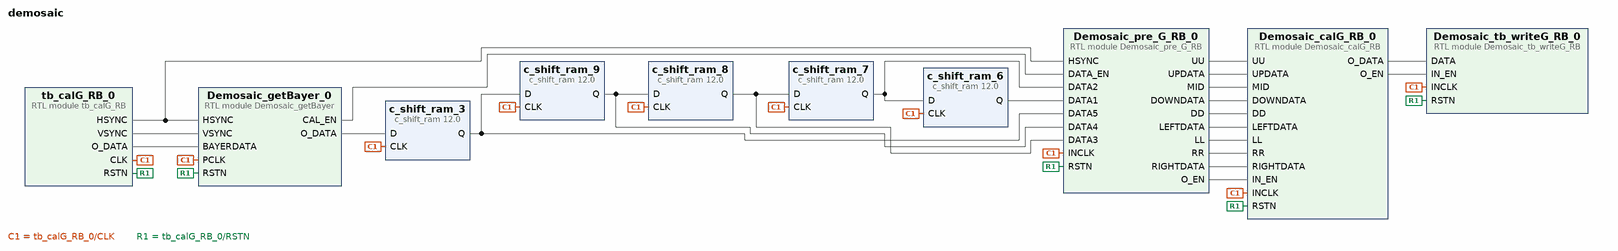
[diagram p0: block diagram of the top level]
# Vivado block design demosaic, xc7z020clg400-2, Vivado 2017.4
create_bd_design demosaic

create_bd_cell -type ip -vlnv xilinx.com:ip:c_shift_ram:12.0 c_shift_ram_3
set_property -dict [list \
  CONFIG.Width 8 \
  CONFIG.Depth 512 \
  CONFIG.DefaultData 00000000 \
  CONFIG.AsyncInitVal 00000000 \
] [get_bd_cells c_shift_ram_3]
create_bd_cell -type ip -vlnv xilinx.com:ip:c_shift_ram:12.0 c_shift_ram_6
set_property -dict [list \
  CONFIG.Width 8 \
  CONFIG.Depth 512 \
  CONFIG.DefaultData 00000000 \
  CONFIG.AsyncInitVal 00000000 \
] [get_bd_cells c_shift_ram_6]
create_bd_cell -type ip -vlnv xilinx.com:ip:c_shift_ram:12.0 c_shift_ram_7
set_property -dict [list \
  CONFIG.Width 8 \
  CONFIG.Depth 512 \
  CONFIG.DefaultData 00000000 \
  CONFIG.AsyncInitVal 00000000 \
] [get_bd_cells c_shift_ram_7]
create_bd_cell -type ip -vlnv xilinx.com:ip:c_shift_ram:12.0 c_shift_ram_8
set_property -dict [list \
  CONFIG.Width 8 \
  CONFIG.Depth 512 \
  CONFIG.DefaultData 00000000 \
  CONFIG.AsyncInitVal 00000000 \
] [get_bd_cells c_shift_ram_8]
create_bd_cell -type ip -vlnv xilinx.com:ip:c_shift_ram:12.0 c_shift_ram_9
set_property -dict [list \
  CONFIG.Width 8 \
  CONFIG.Depth 512 \
  CONFIG.DefaultData 00000000 \
  CONFIG.AsyncInitVal 00000000 \
] [get_bd_cells c_shift_ram_9]
create_bd_cell -type module -reference Demosaic_tb_writeG_RB Demosaic_tb_writeG_RB_0
create_bd_cell -type module -reference tb_calG_RB tb_calG_RB_0
create_bd_cell -type module -reference Demosaic_getBayer Demosaic_getBayer_0
create_bd_cell -type module -reference Demosaic_pre_G_RB Demosaic_pre_G_RB_0
set_property -dict {CONFIG.Cols 532} [get_bd_cells Demosaic_pre_G_RB_0]
create_bd_cell -type module -reference Demosaic_calG_RB Demosaic_calG_RB_0

# ---- connections ----

connect_bd_net [get_bd_pins tb_calG_RB_0/HSYNC] [get_bd_pins Demosaic_getBayer_0/HSYNC] [get_bd_pins Demosaic_pre_G_RB_0/HSYNC]
connect_bd_net [get_bd_pins tb_calG_RB_0/VSYNC] [get_bd_pins Demosaic_getBayer_0/VSYNC]
connect_bd_net [get_bd_pins tb_calG_RB_0/O_DATA] [get_bd_pins Demosaic_getBayer_0/BAYERDATA]
connect_bd_net [get_bd_pins tb_calG_RB_0/CLK] \
  [get_bd_pins c_shift_ram_6/CLK] [get_bd_pins c_shift_ram_7/CLK] [get_bd_pins c_shift_ram_8/CLK] \
  [get_bd_pins c_shift_ram_9/CLK] [get_bd_pins c_shift_ram_3/CLK] [get_bd_pins Demosaic_tb_writeG_RB_0/INCLK] \
  [get_bd_pins Demosaic_getBayer_0/PCLK] [get_bd_pins Demosaic_pre_G_RB_0/INCLK] [get_bd_pins Demosaic_calG_RB_0/INCLK]
connect_bd_net [get_bd_pins Demosaic_calG_RB_0/O_DATA] [get_bd_pins Demosaic_tb_writeG_RB_0/DATA]
connect_bd_net [get_bd_pins Demosaic_pre_G_RB_0/UU] [get_bd_pins Demosaic_calG_RB_0/UU]
connect_bd_net [get_bd_pins Demosaic_pre_G_RB_0/UPDATA] [get_bd_pins Demosaic_calG_RB_0/UPDATA]
connect_bd_net [get_bd_pins Demosaic_pre_G_RB_0/MID] [get_bd_pins Demosaic_calG_RB_0/MID]
connect_bd_net [get_bd_pins Demosaic_pre_G_RB_0/DOWNDATA] [get_bd_pins Demosaic_calG_RB_0/DOWNDATA]
connect_bd_net [get_bd_pins Demosaic_pre_G_RB_0/DD] [get_bd_pins Demosaic_calG_RB_0/DD]
connect_bd_net [get_bd_pins Demosaic_pre_G_RB_0/LEFTDATA] [get_bd_pins Demosaic_calG_RB_0/LEFTDATA]
connect_bd_net [get_bd_pins Demosaic_pre_G_RB_0/LL] [get_bd_pins Demosaic_calG_RB_0/LL]
connect_bd_net [get_bd_pins Demosaic_pre_G_RB_0/RR] [get_bd_pins Demosaic_calG_RB_0/RR]
connect_bd_net [get_bd_pins Demosaic_pre_G_RB_0/RIGHTDATA] [get_bd_pins Demosaic_calG_RB_0/RIGHTDATA]
connect_bd_net [get_bd_pins Demosaic_pre_G_RB_0/O_EN] [get_bd_pins Demosaic_calG_RB_0/IN_EN]
connect_bd_net [get_bd_pins Demosaic_calG_RB_0/O_EN] [get_bd_pins Demosaic_tb_writeG_RB_0/IN_EN]
connect_bd_net [get_bd_pins tb_calG_RB_0/RSTN] \
  [get_bd_pins Demosaic_tb_writeG_RB_0/RSTN] [get_bd_pins Demosaic_getBayer_0/RSTN] [get_bd_pins Demosaic_pre_G_RB_0/RSTN] \
  [get_bd_pins Demosaic_calG_RB_0/RSTN]
connect_bd_net [get_bd_pins Demosaic_getBayer_0/CAL_EN] [get_bd_pins Demosaic_pre_G_RB_0/DATA_EN]
connect_bd_net [get_bd_pins Demosaic_getBayer_0/O_DATA] [get_bd_pins c_shift_ram_3/D]
connect_bd_net [get_bd_pins c_shift_ram_3/Q] [get_bd_pins c_shift_ram_9/D] [get_bd_pins Demosaic_pre_G_RB_0/DATA5]
connect_bd_net [get_bd_pins c_shift_ram_9/Q] [get_bd_pins c_shift_ram_8/D] [get_bd_pins Demosaic_pre_G_RB_0/DATA4]
connect_bd_net [get_bd_pins c_shift_ram_8/Q] [get_bd_pins c_shift_ram_7/D] [get_bd_pins Demosaic_pre_G_RB_0/DATA3]
connect_bd_net [get_bd_pins c_shift_ram_7/Q] [get_bd_pins c_shift_ram_6/D] [get_bd_pins Demosaic_pre_G_RB_0/DATA2]
connect_bd_net [get_bd_pins c_shift_ram_6/Q] [get_bd_pins Demosaic_pre_G_RB_0/DATA1]

validate_bd_design
save_bd_design
